# EAGLE schematic PWM (EAGLE 7.7.0)
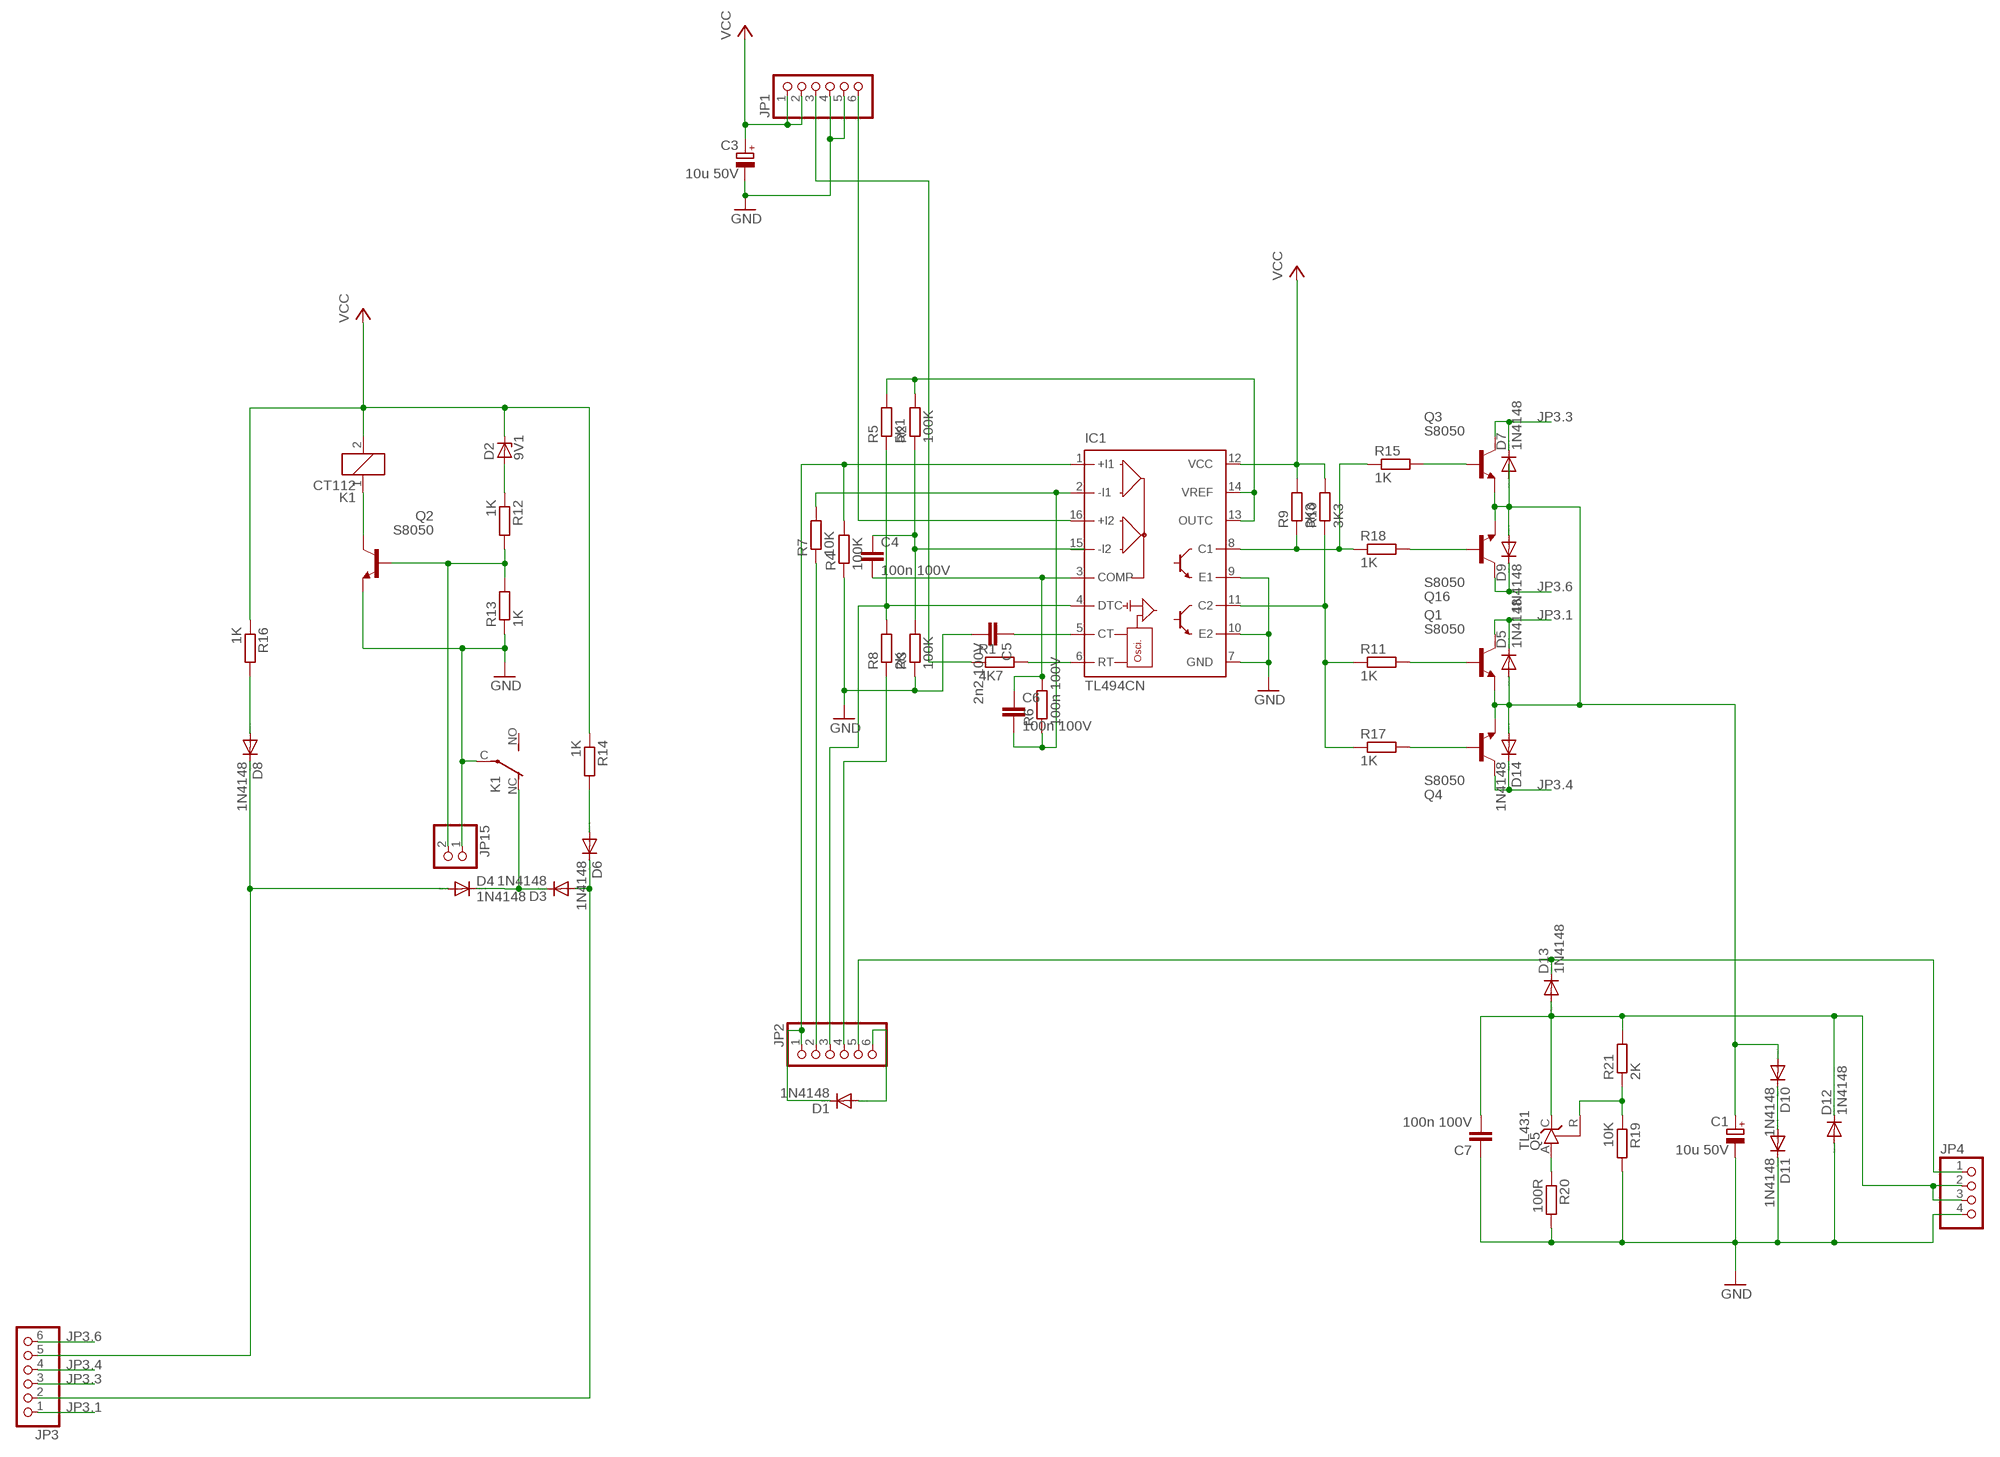
[diagram p0: schematic, sheet 1]

## Parts
C1  10u 50V  CPOL-EUE2.5-5  [E2,5-5]
C3  10u 50V  CPOL-EUE2.5-5  [E2,5-5]
C4  100n 100V  C-EUC1206  [C1206]
C5  2n2 100V  C-EUC1206  [C1206]
C6  100n 100V  C-EUC1206  [C1206]
C7  100n 100V  C-EUC1206  [C1206]
D1  1N4148  DIODE-MINIMELF  [MINIMELF]
D2  9V1  ZENER-DIODESOD80C  [SOD80C]
D3  1N4148  DIODE-MINIMELF  [MINIMELF]
D4  1N4148  DIODE-MINIMELF  [MINIMELF]
D5  1N4148  DIODE-MINIMELF  [MINIMELF]
D6  1N4148  DIODE-MINIMELF  [MINIMELF]
D7  1N4148  DIODE-MINIMELF  [MINIMELF]
D8  1N4148  DIODE-MINIMELF  [MINIMELF]
D9  1N4148  DIODE-MINIMELF  [MINIMELF]
D10  1N4148  DIODE-MINIMELF  [MINIMELF]
D11  1N4148  DIODE-MINIMELF  [MINIMELF]
D12  1N4148  DIODE-MINIMELF  [MINIMELF]
D13  1N4148  DIODE-MINIMELF  [MINIMELF]
D14  1N4148  DIODE-MINIMELF  [MINIMELF]
IC1  TL494CN  [DIL16]
JP1  PINHD-1X6  [1X06]
JP2  PINHD-1X6  [1X06]
JP3  PINHD-1X6  [1X06]
JP4  PINHD-1X4  [1X04]
JP15  PINHD-1X2  [1X02]
K1  CT112  [CT-SLIM]
Q1  S8050  BC817-16LT1SMD  [SOT23-BEC]
Q2  S8050  BC817-16LT1SMD  [SOT23-BEC]
Q3  S8050  BC817-16LT1SMD  [SOT23-BEC]
Q4  S8050  BC817-16LT1SMD  [SOT23-BEC]
Q5  TL431  TL431-IDBVR  [SOT23-5]
Q16  S8050  BC817-16LT1SMD  [SOT23-BEC]
R1  4K7  R-EU_R1206  [R1206]
R2  100K  R-EU_R1206  [R1206]
R3  100K  R-EU_R1206  [R1206]
R4  100K  R-EU_R1206  [R1206]
R5  5K1  R-EU_R1206  [R1206]
R6  100n 100V  R-EU_R1206  [R1206]
R7  10K  R-EU_R1206  [R1206]
R8  2K  R-EU_R1206  [R1206]
R9  3K3  R-EU_R1206  [R1206]
R10  3K3  R-EU_R1206  [R1206]
R11  1K  R-EU_R1206  [R1206]
R12  1K  R-EU_R1206  [R1206]
R13  1K  R-EU_R1206  [R1206]
R14  1K  R-EU_R1206  [R1206]
R15  1K  R-EU_R1206  [R1206]
R16  1K  R-EU_R1206  [R1206]
R17  1K  R-EU_R1206  [R1206]
R18  1K  R-EU_R1206  [R1206]
R19  10K  R-EU_R1206  [R1206]
R20  100R  R-EU_R1206  [R1206]
R21  2K  R-EU_R1206  [R1206]

## Nets
GND: C1.- C3.- C5.2 C7.1 D11.C D12.A IC1.7(GND) IC1.9(E1) IC1.10(E2) JP1.4 JP1.5 JP4.4 JP15.1 K1.C(2:P) Q2.E R3.1 R4.1 R13.1 R19.2 R20.2
JP3.1: D5.C JP3.1 Q1.C
JP3.3: D7.C JP3.3 Q3.C
JP3.4: D14.C JP3.4 Q4.C
JP3.6: D9.C JP3.6 Q16.C
N1: D1.C IC1.1(+I1) JP2.1 R4.2
N$1: C4.2 C6.1 IC1.3(COMP) R6.2
N$2: IC1.8(C1) R9.1 R15.1 R18.1
N$3: C6.2 IC1.2(-I1) R6.1 R7.2
N$4: C4.1 R2.1 R3.2
N$5: Q4.B R17.2
N$6: JP2.2 R7.1
N$7: IC1.4(DTC) JP2.3 R5.1 R8.2
N$8: D13.C JP2.5 JP4.1
N$9: JP2.4 R8.1
N$10: C7.2 D12.C D13.A JP4.2 JP4.3 Q5.C R21.2
N$11: D1.A JP2.6
N$12: C1.+ D5.A D7.A D9.A D10.A D14.A Q1.E Q3.E Q4.E Q16.E
N$13: Q16.B R18.2
N$14: IC1.11(C2) R10.1 R11.1 R17.1
N$15: D3.A D6.C JP3.2
N$16: D6.A R14.2
N$17: IC1.16(+I2) JP1.6
N$18: C5.1 IC1.5(CT)
N$19: Q5.R R19.1 R21.1
N$20: JP15.2 Q2.B R12.2 R13.2
N$21: Q3.B R15.2
N$22: D10.C D11.A
N$25: D4.A D8.C JP3.5
N$26: IC1.6(RT) R1.2
N$29: Q5.A R20.1
N$31: D8.A R16.2
N$32: JP1.3 R1.1
N$33: D3.C D4.C K1.NC(2:O)
N$34: D2.A R12.1
N$35: K1.1 Q2.C
N$36: Q1.B R11.2
N$41: IC1.13(OUTC) IC1.14(VREF) R2.2 R5.2
VCC: C3.+ D2.C IC1.12(VCC) JP1.1 JP1.2 K1.2 R9.2 R10.2 R14.1 R16.1
Unconnected: IC1.15(-I2) K1.NO(2:S)

## Notes on the sheet
- D:/Untitled-2.bmp
- D:/pamdaor.bmp
- D:/roadmap.bmp

## Library data of the parts
C1 C3 = rcl:CPOL-EU: POLARIZED CAPACITOR, European symbol
C4-C7 = rcl:C-EU: CAPACITOR, European symbol
D1 D3-D14 = diode:DIODE-: DIODE
D2 = diode:ZENER-DIODE: Z-Diode
IC1 = linear:TL494*: SWITCHMODE Pulse Width Modulation Control Circuit NCV494B http://onsemi.com tl494-d.pdf
JP1-JP3 = pinhead:PINHD-1X6: PIN HEADER
JP4 = pinhead:PINHD-1X4: PIN HEADER
JP15 = pinhead:PINHD-1X2: PIN HEADER
K1 = relay:CT112: ULTRA SMALL AUTOMOTIVE RELAY NAiS Slim 1c type en_ds_61205_0000.pdf; OC_FARNELL: unknown; OC_NEWARK: unknown
Q1-Q4 Q16 = transistor-npn:BC817*: NPN Transistor
Q5 = TL431:TL431-IDBVR
R1-R21 = rcl:R-EU_: RESISTOR, European symbol